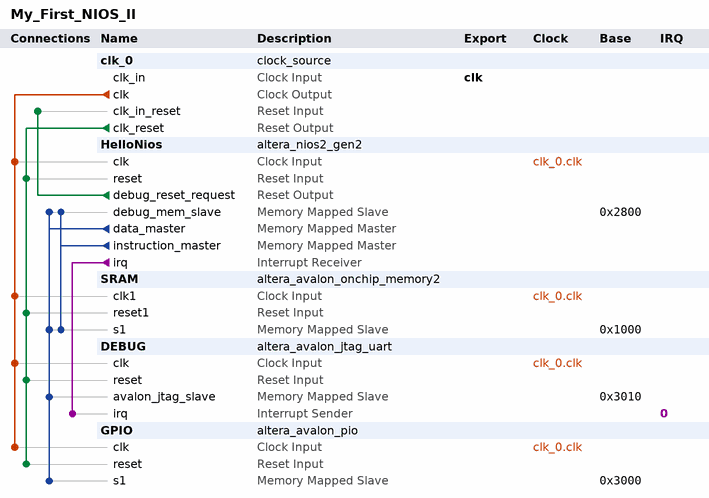
[diagram p0: system contents]
# Platform Designer (Qsys) system My_First_NIOS_II, Cyclone 10 LP 10CL025YU256I7G
# Parameters at their usual value, and those the tool derives, are not listed.
package require -exact qsys 18.1
create_system My_First_NIOS_II
set_project_property DEVICE_FAMILY {Cyclone 10 LP}
set_project_property DEVICE 10CL025YU256I7G

add_instance clk_0 clock_source 18.1
set_instance_parameter_value clk_0 clockFrequency 50000000

add_instance HelloNios altera_nios2_gen2 18.1
set_instance_parameter_value HelloNios dcache_size 2048
set_instance_parameter_value HelloNios exceptionSlave SRAM.s1
set_instance_parameter_value HelloNios icache_size 4096
set_instance_parameter_value HelloNios impl Fast
set_instance_parameter_value HelloNios resetSlave SRAM.s1

add_instance SRAM altera_avalon_onchip_memory2 18.1
set_instance_parameter_value SRAM dataWidth 32
set_instance_parameter_value SRAM dualPort false
set_instance_parameter_value SRAM initMemContent true
set_instance_parameter_value SRAM initializationFileName onchip_mem.hex
set_instance_parameter_value SRAM memorySize 4096

add_instance DEBUG altera_avalon_jtag_uart 18.1
set_instance_parameter_value DEBUG simInteractiveOptions NO_INTERACTIVE_WINDOWS

add_instance GPIO altera_avalon_pio 18.1
set_instance_parameter_value GPIO direction Output
set_instance_parameter_value GPIO width 8

# connections
add_connection clk_0.clk DEBUG.clk clock
add_connection clk_0.clk GPIO.clk clock
add_connection clk_0.clk HelloNios.clk clock
add_connection clk_0.clk SRAM.clk1 clock
add_connection clk_0.clk_reset DEBUG.reset reset
add_connection clk_0.clk_reset GPIO.reset reset
add_connection clk_0.clk_reset HelloNios.reset reset
add_connection clk_0.clk_reset SRAM.reset1 reset
add_connection HelloNios.debug_reset_request clk_0.clk_in_reset reset
add_connection HelloNios.data_master DEBUG.avalon_jtag_slave avalon
set_connection_parameter_value HelloNios.data_master/DEBUG.avalon_jtag_slave baseAddress 0x3010
add_connection HelloNios.data_master GPIO.s1 avalon
set_connection_parameter_value HelloNios.data_master/GPIO.s1 baseAddress 0x3000
add_connection HelloNios.data_master HelloNios.debug_mem_slave avalon
set_connection_parameter_value HelloNios.data_master/HelloNios.debug_mem_slave baseAddress 0x2800
add_connection HelloNios.data_master SRAM.s1 avalon
set_connection_parameter_value HelloNios.data_master/SRAM.s1 baseAddress 0x1000
add_connection HelloNios.instruction_master HelloNios.debug_mem_slave avalon
set_connection_parameter_value HelloNios.instruction_master/HelloNios.debug_mem_slave baseAddress 0x2800
add_connection HelloNios.instruction_master SRAM.s1 avalon
set_connection_parameter_value HelloNios.instruction_master/SRAM.s1 baseAddress 0x1000
add_connection HelloNios.irq DEBUG.irq interrupt
set_connection_parameter_value HelloNios.irq/DEBUG.irq irqNumber 0

# exported interfaces
add_interface clk clock sink
set_interface_property clk EXPORT_OF clk_0.clk_in

set_interconnect_requirement {$system} qsys_mm.clockCrossingAdapter HANDSHAKE
set_interconnect_requirement {$system} qsys_mm.enableEccProtection FALSE
set_interconnect_requirement {$system} qsys_mm.insertDefaultSlave FALSE
set_interconnect_requirement {$system} qsys_mm.maxAdditionalLatency 1

save_system My_First_NIOS_II.qsys
